# EasyEDA Pro project ProPrj_PCB_2025-05-19.epro, schematic Schematic1
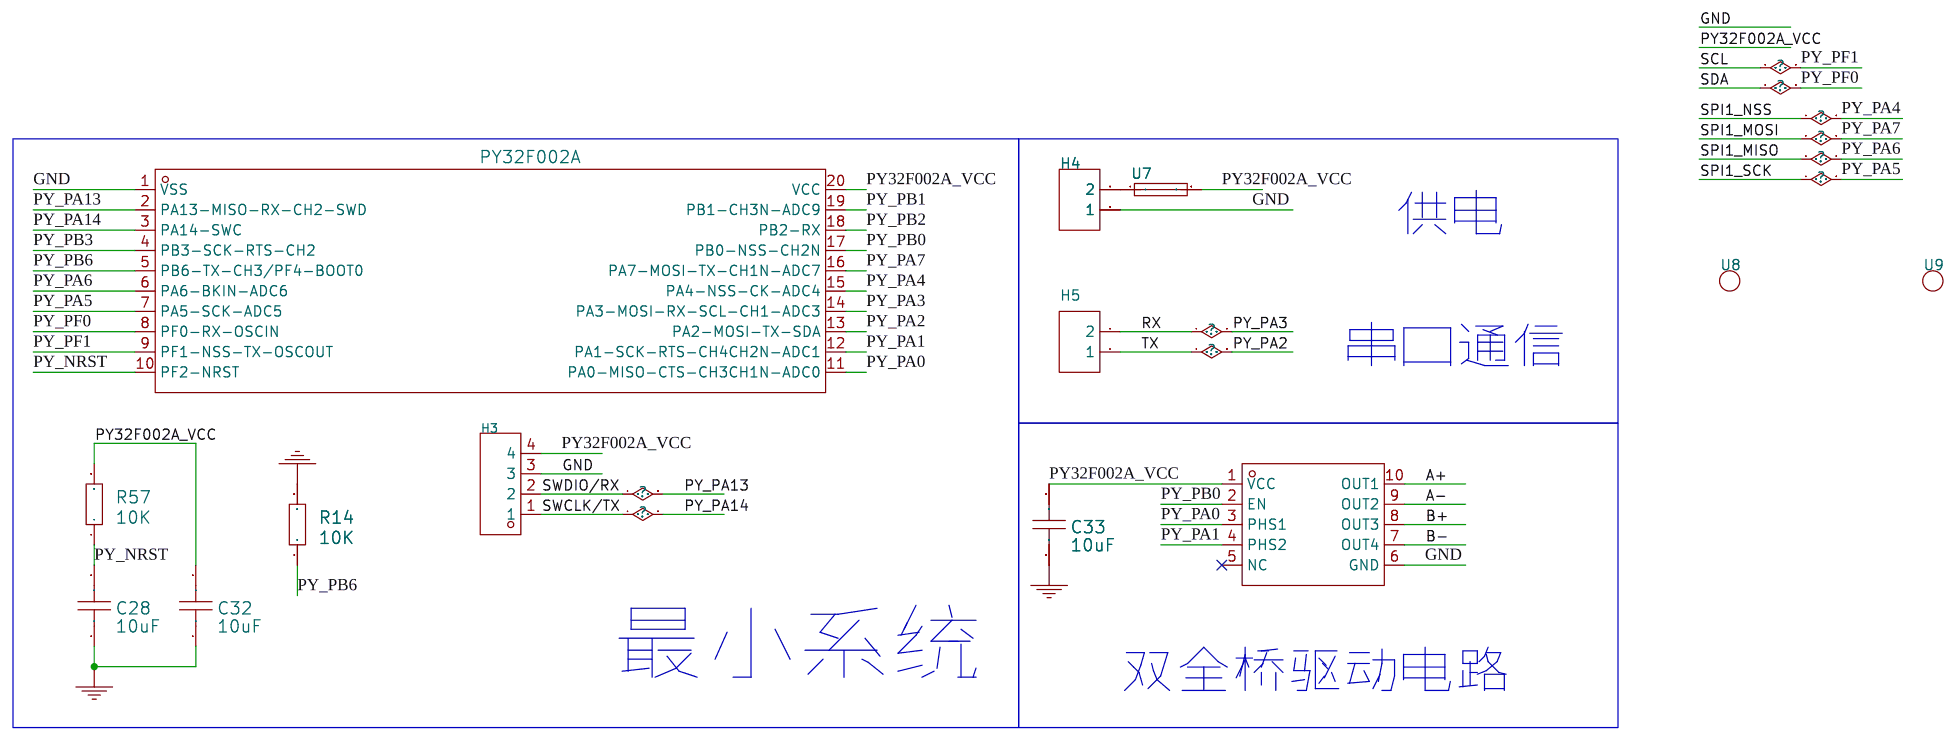
[diagram p0: schematic sheet]

## Parts
C28  10uF  [C0603]
C32  10uF  [C0603]
C33  10uF  [C0603]
H3  -  [HDR-TH_4P-P2.54-V-F]
H4  -  [HDR-TH_2P-P2.54-V-F]
H5  -  [HDR-TH_2P-P2.54-V-F]
R14  10K  [R0603]
R57  10K  [R0603]
U2  AT8549  [SSOP-10_L4.9-W3.9-P1.00-LS6.0-BL]
U6  PY32F002A  [TSSOP-20_L6.5-W4.4-P0.65-LS6.4-BL]
U7  BSMD0805-050-12V  [F0805]
U8  -  [手指杆组]
U9  -  [关节手指]

## Library data of the parts
C28 C32 C33 = 100nF: link: https://item.szlcsc.com/362304.html; 3DModel: C0603_L1.6-W0.8-H0.8; Supplier: LCSC; Manufacturer: YAGEO; Manufacturer Part: CC0603KRX7R9BB104; Supplier Part: C14663; JLCPCB Part Class: Basic; JLCPCB SMD: Yes
H3 = HDR-F_2.54_1x4P: Supplier Part: C2718488; Supplier Footprint: 插件
H4 H5 = HDR-F_2.54_1x2P: Supplier Part: C49661; Supplier Footprint: 插件
R14 R57 = 10K: link: https://item.szlcsc.com/137208.html; 3DModel: R0603_L1.6-W0.8-H0.8; Supplier: LCSC; Manufacturer: UniOhm; Manufacturer Part: 0603WAF4701T5E; Supplier Part: C23162; JLCPCB Part Class: Basic; JLCPCB SMD: Yes
U2 = AT8549: Supplier Part: C2901460; Manufacturer: 杭州中科微; Supplier Footprint: SSOP-10-150mil; JLCPCB Part Class: 扩展库; Datasheet: https://atta.szlcsc.com/upload/public/pdf/source/20210922/7D297391A106973500C7B01D506ACF09.pdf; Supplier: LCSC
U6 = PY32F002AF15P6TU: link: https://atta.szlcsc.com/upload/public/pdf/source/20221129/96B7CEAD099C412BFB9DFB97170A788E.pdf; 3DModel: TSSOP-20_L6.5-W4.4-H1.0-LS6.4-P0.65; Supplier: LCSC; Supplier Part: C5292059; Manufacturer: PUYA(普冉); JLCPCB Part Class: Extended Part
U7 = BSMD0805-050-12V: 最大电压:12V;最大电流:40A;保持电流:500mA;跳闸电流:1A;; LCSC Part Name: 12V 0.5A 0805自恢复; Supplier Part: C2977522; Manufacturer: BHFUSE(佰宏); Supplier Footprint: 0805; JLCPCB Part Class: 扩展库; Datasheet: https://atta.szlcsc.com/upload/public/pdf/source/20230512/7A46D6CD923C15CBB98FD769C08EDD80.pdf; Supplier: LCSC; Operating Voltage (Max): 12V; Current Rating (Max): 40A; Hold Current: 500mA; Trip Current: 1A; Power Dissipation: 500mW; Resistance - Initial (Ri) (Min): 100mΩ; Resistance - Post Trip (R1) (Max): 850mΩ; Maximum Time to Trip: 100ms
U8 U9 = m.2嵌套定位

## Nets
GND: C28.1 C32.1 C33.1 H3.3 H4.1 R14.2 U2.6(GND) U6.1(VSS)
A+: U2.10(OUT1)
A-: U2.9(OUT2)
B+: U2.8(OUT3)
B-: U2.7(OUT4)
PY32F002A_VCC: C32.2 C33.2 H3.4 R57.2 U2.1(VCC) U6.20(VCC) U7.2
PY_NRST: C28.2 R57.1 U6.10(PF2-NRST)
PY_PA0: U2.3(PHS1) U6.11(PA0-MISO-CTS-CH3CH1N-ADC0)
PY_PA1: U2.4(PHS2) U6.12(PA1-SCK-RTS-CH4CH2N-ADC1)
PY_PA2: H5.1 U6.13(PA2-MOSI-TX-SDA)
PY_PA3: H5.2 U6.14(PA3-MOSI-RX-SCL-CH1-ADC3)
PY_PA4: U6.15(PA4-NSS-CK-ADC4)
PY_PA5: U6.7(PA5-SCK-ADC5)
PY_PA6: U6.6(PA6-BKIN-ADC6)
PY_PA7: U6.16(PA7-MOSI-TX-CH1N-ADC7)
PY_PA13: H3.2 U6.2(PA13-MISO-RX-CH2-SWD)
PY_PA14: H3.1 U6.3(PA14-SWC)
PY_PB0: U2.2(EN) U6.17(PB0-NSS-CH2N)
PY_PB1: U6.19(PB1-CH3N-ADC9)
PY_PB2: U6.18(PB2-RX)
PY_PB3: U6.4(PB3-SCK-RTS-CH2)
PY_PB6: R14.1 U6.5(PB6-TX-CH3/PF4-BOOT0)
PY_PF0: U6.8(PF0-RX-OSCIN)
PY_PF1: U6.9(PF1-NSS-TX-OSCOUT)
$1N4187: H4.2 U7.1

Not connected (* = marked no-connect by the designer): U2 5(NC)*

## Notes on the sheet
- 供电
- 串口通信
- 最小系统
- 双全桥驱动电路
